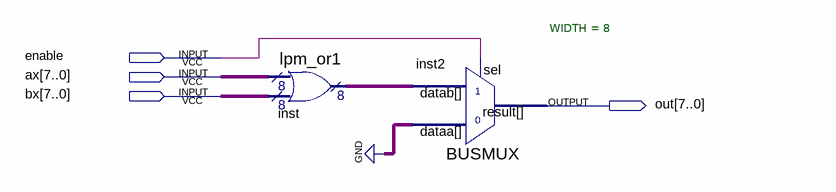
[diagram p0: schematic sheet]
// Quartus schematic ALU_OR.bdf as structural Verilog: 2 symbols, 4 pins
module ALU_OR (
  input  enable,
  input  [7:0] ax,
  input  [7:0] bx,
  output [7:0] out
);

  wire [7:0] inst_result;

  lpm_or1 inst (.data0x(ax), .data1x(bx), .result(inst_result));
  BUSMUX #(.WIDTH(8)) inst2 (.datab(inst_result), .sel(enable), .dataa({8{1'b0}}), .result(out));
endmodule
